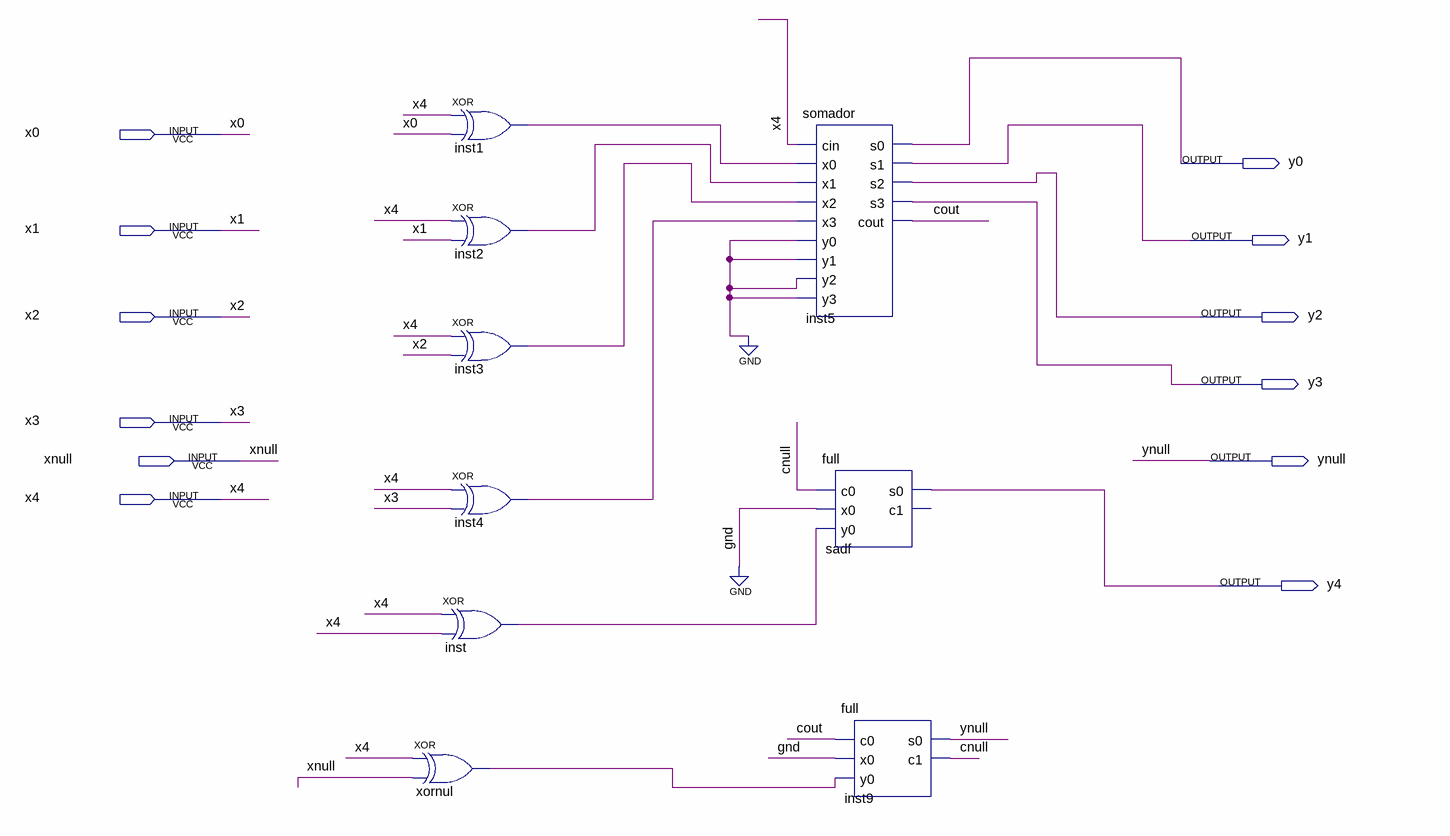
[diagram p0: schematic sheet]
// Quartus schematic tonormal.bdf as structural Verilog: 9 symbols, 12 pins
module tonormal (
  input  x0,
  input  x1,
  input  x2,
  input  x3,
  input  xnull,
  input  x4,
  output y0,
  output y1,
  output y2,
  output y3,
  output ynull,
  output y4
);

  wire cnull, cout, inst1_out, inst2_out, inst3_out, inst4_out, inst_out, xornul_out;

  xor xornul (xornul_out, x4, xnull);
  xor inst1 (inst1_out, x4, x0);
  xor inst2 (inst2_out, x4, x1);
  xor inst3 (inst3_out, x4, x2);
  xor inst4 (inst4_out, x4, x3);
  xor inst (inst_out, x4, x4);
  somador inst5 (
    .cin(x4), .x0(inst1_out), .x1(inst2_out), .x2(inst3_out), .x3(inst4_out), .y0(1'b0), .y1(1'b0),
    .y2(1'b0), .y3(1'b0), .s0(y0), .s1(y1), .s2(y2), .s3(y3), .cout(cout));
  full sadf (.c0(cnull), .x0(1'b0), .y0(inst_out), .s0(y4));  // open: c1
  full inst9 (.c0(cout), .x0(1'b0), .y0(xornul_out), .s0(ynull), .c1(cnull));
endmodule
